# EAGLE schematic regsimple2addfp (EAGLE 7.6.0)

## Sheet 1 of 2
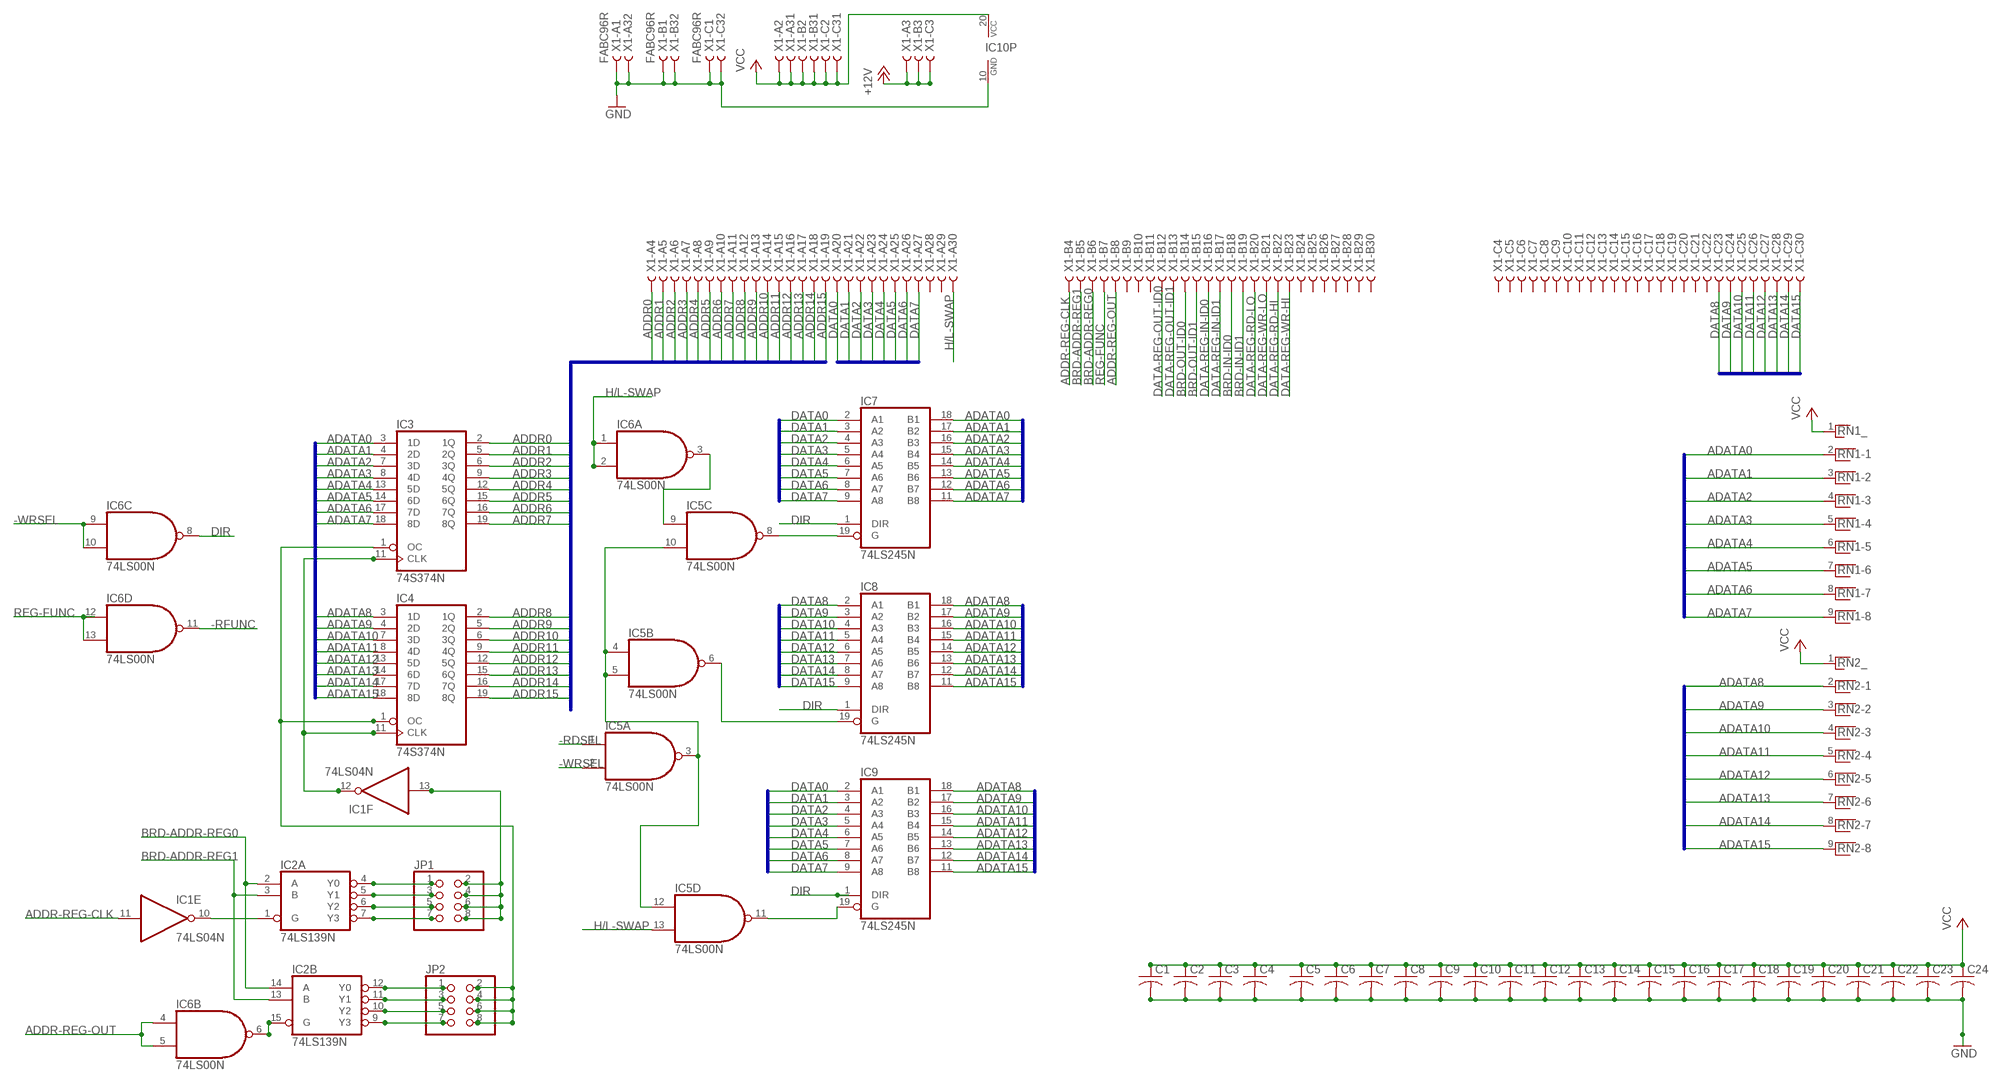
[diagram p0: schematic, sheet 1]

### Parts
C1  C-US025-040X050  [C025-040X050]
C2  C-US025-040X050  [C025-040X050]
C3  C-US025-040X050  [C025-040X050]
C4  C-US025-040X050  [C025-040X050]
C5  C-US025-040X050  [C025-040X050]
C6  C-US025-040X050  [C025-040X050]
C7  C-US025-040X050  [C025-040X050]
C8  C-US025-040X050  [C025-040X050]
C9  C-US025-040X050  [C025-040X050]
C10  C-US025-040X050  [C025-040X050]
C11  C-US025-040X050  [C025-040X050]
C12  C-US025-040X050  [C025-040X050]
C13  C-US025-040X050  [C025-040X050]
C14  C-US025-040X050  [C025-040X050]
C15  C-US025-040X050  [C025-040X050]
C16  C-US025-040X050  [C025-040X050]
C17  C-US025-040X050  [C025-040X050]
C18  C-US025-040X050  [C025-040X050]
C19  C-US025-040X050  [C025-040X050]
C20  C-US025-040X050  [C025-040X050]
C21  C-US025-040X050  [C025-040X050]
C22  C-US025-040X050  [C025-040X050]
C23  C-US025-040X050  [C025-040X050]
C24  C-US025-040X050  [C025-040X050]
IC1  74LS04N  [DIL14]
IC2  74LS139N  [DIL16]
IC3  74S374N  [DIL20]
IC4  74S374N  [DIL20]
IC5  74LS00N  [DIL14]
IC6  74LS00N  [DIL14]
IC7  74LS245N  [DIL20]
IC8  74LS245N  [DIL20]
IC9  74LS245N  [DIL20]
IC10  74S244N  [DIL20]
JP1  PINHD-2X4  [2X04]
JP2  PINHD-2X4  [2X04]
RN1  RNX8  [RN-9]
RN2  RNX8  [RN-9]
X1  FABC96R  [FABC96R]

### Nets
+12V: X1.A3 X1.B3 X1.C3
-RDSEL: IC5.1(A:I0) ; also sheet 2
-RFUNC: IC6.11(D:O) ; also sheet 2
-WRSEL: IC5.2(A:I1) IC6.9(C:I0) IC6.10(C:I1) ; also sheet 2
ADATA0: IC3.3(1D) IC7.18(B1) RN1.2 ; also sheet 2
ADATA1: IC3.4(2D) IC7.17(B2) RN1.3 ; also sheet 2
ADATA2: IC3.7(3D) IC7.16(B3) RN1.4 ; also sheet 2
ADATA3: IC3.8(4D) IC7.15(B4) RN1.5 ; also sheet 2
ADATA4: IC3.13(5D) IC7.14(B5) RN1.6 ; also sheet 2
ADATA5: IC3.14(6D) IC7.13(B6) RN1.7 ; also sheet 2
ADATA6: IC3.17(7D) IC7.12(B7) RN1.8 ; also sheet 2
ADATA7: IC3.18(8D) IC7.11(B8) RN1.9 ; also sheet 2
ADATA8: IC4.3(1D) IC8.18(B1) IC9.18(B1) RN2.2 ; also sheet 2
ADATA9: IC4.4(2D) IC8.17(B2) IC9.17(B2) RN2.3 ; also sheet 2
ADATA10: IC4.7(3D) IC8.16(B3) IC9.16(B3) RN2.4 ; also sheet 2
ADATA11: IC4.8(4D) IC8.15(B4) IC9.15(B4) RN2.5 ; also sheet 2
ADATA12: IC4.13(5D) IC8.14(B5) IC9.14(B5) RN2.6 ; also sheet 2
ADATA13: IC4.14(6D) IC8.13(B6) IC9.13(B6) RN2.7 ; also sheet 2
ADATA14: IC4.17(7D) IC8.12(B7) IC9.12(B7) RN2.8 ; also sheet 2
ADATA15: IC4.18(8D) IC8.11(B8) IC9.11(B8) RN2.9 ; also sheet 2
ADDR0: IC3.2(1Q) X1.A4
ADDR1: IC3.5(2Q) X1.A5
ADDR2: IC3.6(3Q) X1.A6
ADDR3: IC3.9(4Q) X1.A7
ADDR4: IC3.12(5Q) X1.A8
ADDR5: IC3.15(6Q) X1.A9
ADDR6: IC3.16(7Q) X1.A10
ADDR7: IC3.19(8Q) X1.A11
ADDR8: IC4.2(1Q) X1.A12
ADDR9: IC4.5(2Q) X1.A13
ADDR10: IC4.6(3Q) X1.A14
ADDR11: IC4.9(4Q) X1.A15
ADDR12: IC4.12(5Q) X1.A16
ADDR13: IC4.15(6Q) X1.A17
ADDR14: IC4.16(7Q) X1.A18
ADDR15: IC4.19(8Q) X1.A19
ADDR-REG-CLK: IC1.11(E:I) X1.B4
ADDR-REG-OUT: IC6.4(B:I0) IC6.5(B:I1) X1.B8
BRD-ADDR-REG0: IC2.2(A:A) IC2.14(B:A) X1.B6
BRD-ADDR-REG1: IC2.3(A:B) IC2.13(B:B) X1.B5
BRD-IN-ID0: X1.B18 ; also sheet 2
BRD-IN-ID1: X1.B19 ; also sheet 2
BRD-OUT-ID0: X1.B14 ; also sheet 2
BRD-OUT-ID1: X1.B15 ; also sheet 2
DATA0: IC7.2(A1) IC9.2(A1) X1.A20
DATA1: IC7.3(A2) IC9.3(A2) X1.A21
DATA2: IC7.4(A3) IC9.4(A3) X1.A22
DATA3: IC7.5(A4) IC9.5(A4) X1.A23
DATA4: IC7.6(A5) IC9.6(A5) X1.A24
DATA5: IC7.7(A6) IC9.7(A6) X1.A25
DATA6: IC7.8(A7) IC9.8(A7) X1.A26
DATA7: IC7.9(A8) IC9.9(A8) X1.A27
DATA8: IC8.2(A1) X1.C23
DATA9: IC8.3(A2) X1.C24
DATA10: IC8.4(A3) X1.C25
DATA11: IC8.5(A4) X1.C26
DATA12: IC8.6(A5) X1.C27
DATA13: IC8.7(A6) X1.C28
DATA14: IC8.8(A7) X1.C29
DATA15: IC8.9(A8) X1.C30
DATA-REG-IN-ID0: X1.B16 ; also sheet 2
DATA-REG-IN-ID1: X1.B17 ; also sheet 2
DATA-REG-OUT-ID0: X1.B12 ; also sheet 2
DATA-REG-OUT-ID1: X1.B13 ; also sheet 2
DATA-REG-RD-HI: X1.B22 ; also sheet 2
DATA-REG-RD-LO: X1.B20 ; also sheet 2
DATA-REG-WR-HI: X1.B23 ; also sheet 2
DATA-REG-WR-LO: X1.B21 ; also sheet 2
DIR: IC6.8(C:O) IC7.1(DIR) IC8.1(DIR) IC9.1(DIR)
GND: C1.2 C2.2 C3.2 C4.2 C5.2 C6.2 C7.2 C8.2 C9.2 C10.2 C11.2 C12.2 C13.2 C14.2 C15.2 C16.2 C17.2 C18.2 C19.2 C20.2 C21.2 C22.2 C23.2 C24.2 IC10.10(P:GND) X1.A1 X1.A32 X1.B1 X1.B32 X1.C1 X1.C32 ; also sheet 2
H/L-SWAP: IC5.13(D:I1) IC6.1(A:I0) IC6.2(A:I1) X1.A30
N$11: IC2.12(B:Y0) JP2.1
N$14: IC1.13(F:I) JP1.2 JP1.4 JP1.6 JP1.8
N$27: IC2.4(A:Y0) JP1.1
N$28: IC2.5(A:Y1) JP1.3
N$29: IC2.6(A:Y2) JP1.5
N$30: IC2.7(A:Y3) JP1.7
N$31: IC3.1(OC) IC4.1(OC) JP2.2 JP2.4 JP2.6 JP2.8
N$32: IC1.10(E:O) IC2.1(A:G)
N$33: IC1.12(F:O) IC3.11(CLK) IC4.11(CLK)
N$34: IC2.11(B:Y1) JP2.3
N$35: IC2.10(B:Y2) JP2.5
N$36: IC2.9(B:Y3) JP2.7
N$37: IC5.11(D:O) IC9.19(G)
N$38: IC5.8(C:O) IC7.19(G)
N$39: IC5.6(B:O) IC8.19(G)
N$40: IC5.3(A:O) IC5.4(B:I0) IC5.5(B:I1) IC5.10(C:I1) IC5.12(D:I0)
N$41: IC5.9(C:I0) IC6.3(A:O)
N$42: IC2.15(B:G) IC6.6(B:O)
REG-FUNC: IC6.12(D:I0) IC6.13(D:I1) X1.B7
VCC: C1.1 C2.1 C3.1 C4.1 C5.1 C6.1 C7.1 C8.1 C9.1 C10.1 C11.1 C12.1 C13.1 C14.1 C15.1 C16.1 C17.1 C18.1 C19.1 C20.1 C21.1 C22.1 C23.1 C24.1 IC10.20(P:VCC) RN1.1 RN2.1 X1.A2 X1.A31 X1.B2 X1.B31 X1.C2 X1.C31
Unconnected: IC10.1(A:G) IC10.2(A:A1) IC10.3(B:Y4) IC10.4(A:A2) IC10.5(B:Y3) IC10.6(A:A3) IC10.7(B:Y2) IC10.8(A:A4) IC10.9(B:Y1) IC10.11(B:A1) IC10.12(A:Y4) IC10.13(B:A2) IC10.14(A:Y3) IC10.15(B:A3) IC10.16(A:Y2) IC10.17(B:A4) IC10.18(A:Y1) IC10.19(B:G) X1.A28 X1.A29 X1.B9 X1.B10 X1.B11 X1.B24 X1.B25 X1.B26 X1.B27 X1.B28 X1.B29 X1.B30 X1.C4 X1.C5 X1.C6 X1.C7 X1.C8 X1.C9 X1.C10 X1.C11 X1.C12 X1.C13 X1.C14 X1.C15 X1.C16 X1.C17 X1.C18 X1.C19 X1.C20 X1.C21 X1.C22

### Buses
ADDR[0..15]
CNTL[0..53],DATA[8..15]
DATA[8..15]
DATA[0..7]
ADATA[0..15]
ADATA[0..7]
ADATA[8..15]

## Sheet 2 of 2
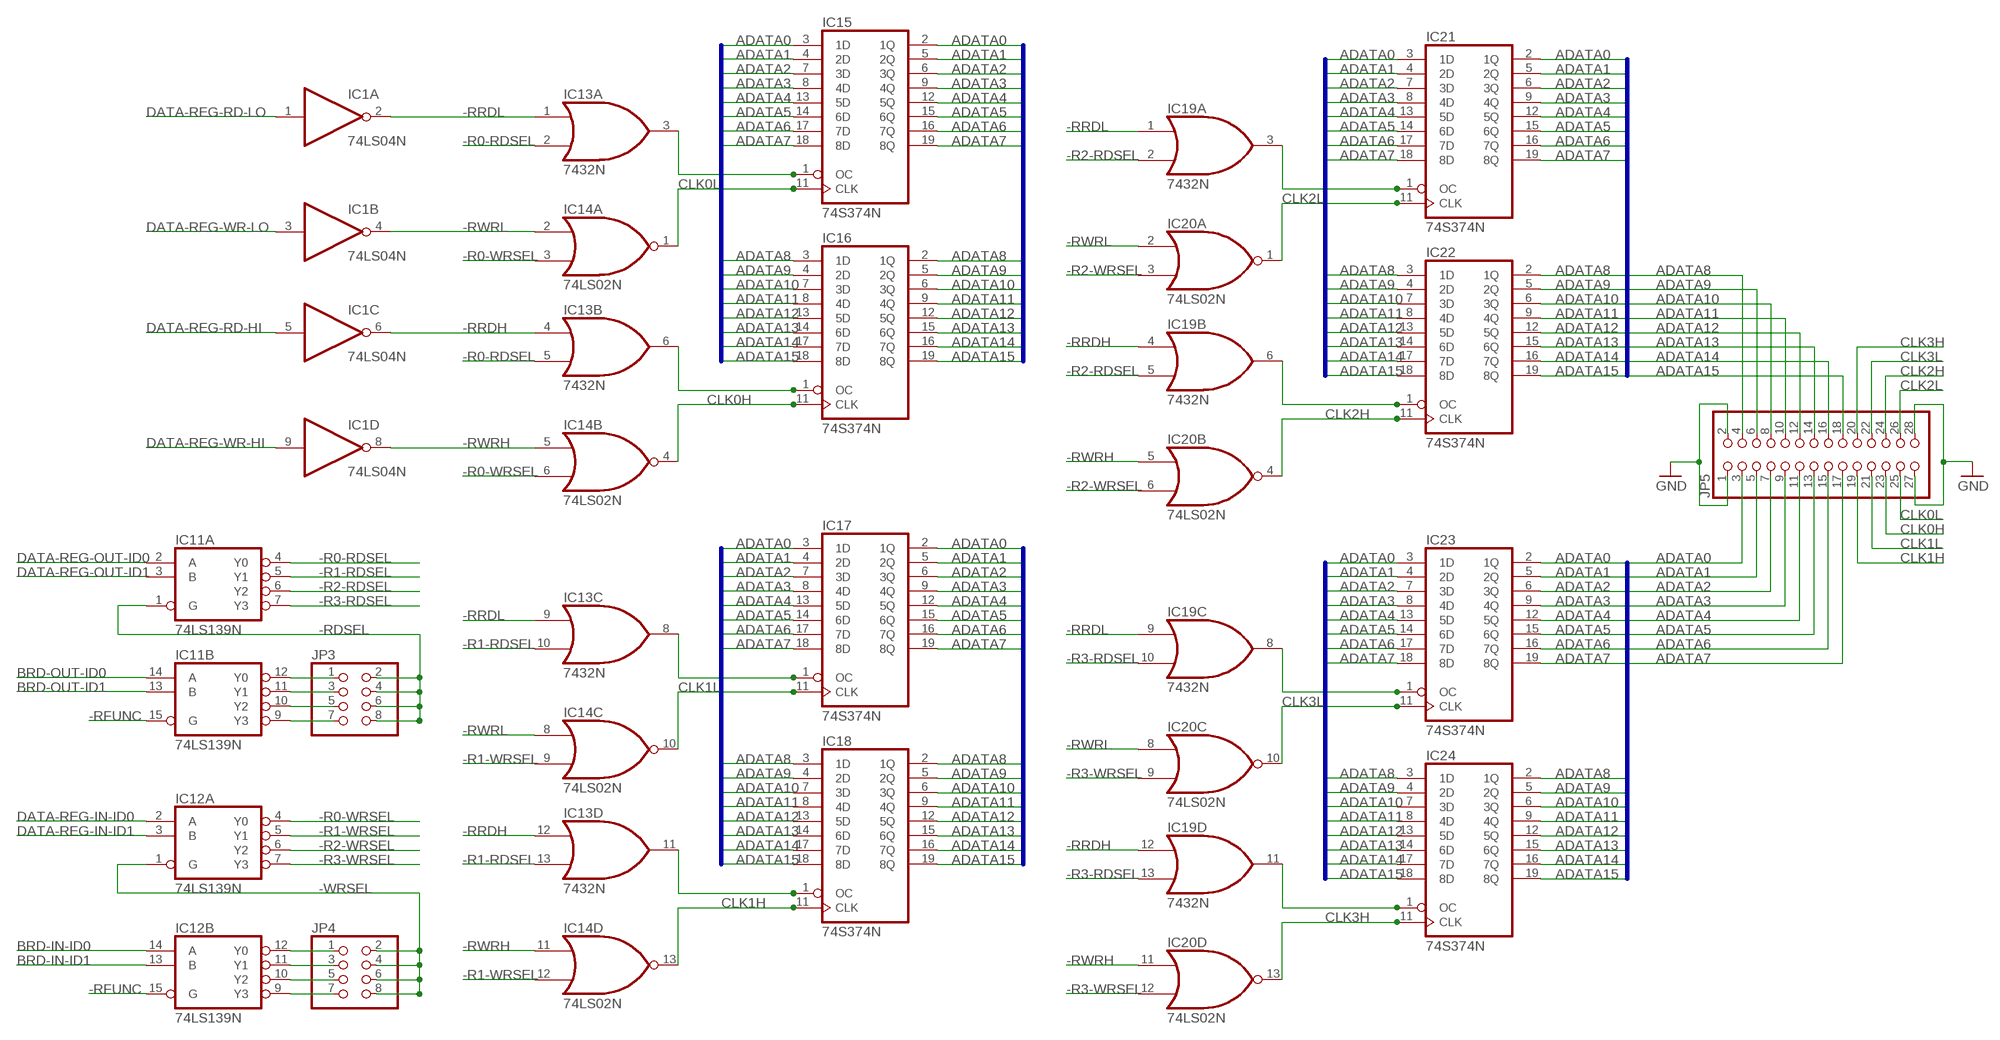
[diagram p1: schematic, sheet 2]

### Parts
IC11  74LS139N  [DIL16]
IC12  74LS139N  [DIL16]
IC13  7432N  [DIL14]
IC14  74LS02N  [DIL14]
IC15  74S374N  [DIL20]
IC16  74S374N  [DIL20]
IC17  74S374N  [DIL20]
IC18  74S374N  [DIL20]
IC19  7432N  [DIL14]
IC20  74LS02N  [DIL14]
IC21  74S374N  [DIL20]
IC22  74S374N  [DIL20]
IC23  74S374N  [DIL20]
IC24  74S374N  [DIL20]
JP3  PINHD-2X4  [2X04]
JP4  PINHD-2X4  [2X04]
JP5  PINHD-2X14  [2X14]

### Nets
-R0-RDSEL: IC11.4(A:Y0) IC13.2(A:I1) IC13.5(B:I1)
-R0-WRSEL: IC12.4(A:Y0) IC14.3(A:I1) IC14.6(B:I1)
-R1-RDSEL: IC11.5(A:Y1) IC13.10(C:I1) IC13.13(D:I1)
-R1-WRSEL: IC12.5(A:Y1) IC14.9(C:I1) IC14.12(D:I1)
-R2-RDSEL: IC11.6(A:Y2) IC19.2(A:I1) IC19.5(B:I1)
-R2-WRSEL: IC12.6(A:Y2) IC20.3(A:I1) IC20.6(B:I1)
-R3-RDSEL: IC11.7(A:Y3) IC19.10(C:I1) IC19.13(D:I1)
-R3-WRSEL: IC12.7(A:Y3) IC20.9(C:I1) IC20.12(D:I1)
-RDSEL: IC11.1(A:G) JP3.2 JP3.4 JP3.6 JP3.8 ; also sheet 1
-RFUNC: IC11.15(B:G) IC12.15(B:G) ; also sheet 1
-RRDH: IC1.6(C:O) IC13.4(B:I0) IC13.12(D:I0) IC19.4(B:I0) IC19.12(D:I0)
-RRDL: IC1.2(A:O) IC13.1(A:I0) IC13.9(C:I0) IC19.1(A:I0) IC19.9(C:I0)
-RWRH: IC1.8(D:O) IC14.5(B:I0) IC14.11(D:I0) IC20.5(B:I0) IC20.11(D:I0)
-RWRL: IC1.4(B:O) IC14.2(A:I0) IC14.8(C:I0) IC20.2(A:I0) IC20.8(C:I0)
-WRSEL: IC12.1(A:G) JP4.2 JP4.4 JP4.6 JP4.8 ; also sheet 1
ADATA0: IC15.2(1Q) IC15.3(1D) IC17.2(1Q) IC17.3(1D) IC21.2(1Q) IC21.3(1D) IC23.2(1Q) IC23.3(1D) JP5.3 ; also sheet 1
ADATA1: IC15.4(2D) IC15.5(2Q) IC17.4(2D) IC17.5(2Q) IC21.4(2D) IC21.5(2Q) IC23.4(2D) IC23.5(2Q) JP5.5 ; also sheet 1
ADATA2: IC15.6(3Q) IC15.7(3D) IC17.6(3Q) IC17.7(3D) IC21.6(3Q) IC21.7(3D) IC23.6(3Q) IC23.7(3D) JP5.7 ; also sheet 1
ADATA3: IC15.8(4D) IC15.9(4Q) IC17.8(4D) IC17.9(4Q) IC21.8(4D) IC21.9(4Q) IC23.8(4D) IC23.9(4Q) JP5.9 ; also sheet 1
ADATA4: IC15.12(5Q) IC15.13(5D) IC17.12(5Q) IC17.13(5D) IC21.12(5Q) IC21.13(5D) IC23.12(5Q) IC23.13(5D) JP5.11 ; also sheet 1
ADATA5: IC15.14(6D) IC15.15(6Q) IC17.14(6D) IC17.15(6Q) IC21.14(6D) IC21.15(6Q) IC23.14(6D) IC23.15(6Q) JP5.13 ; also sheet 1
ADATA6: IC15.16(7Q) IC15.17(7D) IC17.16(7Q) IC17.17(7D) IC21.16(7Q) IC21.17(7D) IC23.16(7Q) IC23.17(7D) JP5.15 ; also sheet 1
ADATA7: IC15.18(8D) IC15.19(8Q) IC17.18(8D) IC17.19(8Q) IC21.18(8D) IC21.19(8Q) IC23.18(8D) IC23.19(8Q) JP5.17 ; also sheet 1
ADATA8: IC16.2(1Q) IC16.3(1D) IC18.2(1Q) IC18.3(1D) IC22.2(1Q) IC22.3(1D) IC24.2(1Q) IC24.3(1D) JP5.4 ; also sheet 1
ADATA9: IC16.4(2D) IC16.5(2Q) IC18.4(2D) IC18.5(2Q) IC22.4(2D) IC22.5(2Q) IC24.4(2D) IC24.5(2Q) JP5.6 ; also sheet 1
ADATA10: IC16.6(3Q) IC16.7(3D) IC18.6(3Q) IC18.7(3D) IC22.6(3Q) IC22.7(3D) IC24.6(3Q) IC24.7(3D) JP5.8 ; also sheet 1
ADATA11: IC16.8(4D) IC16.9(4Q) IC18.8(4D) IC18.9(4Q) IC22.8(4D) IC22.9(4Q) IC24.8(4D) IC24.9(4Q) JP5.10 ; also sheet 1
ADATA12: IC16.12(5Q) IC16.13(5D) IC18.12(5Q) IC18.13(5D) IC22.12(5Q) IC22.13(5D) IC24.12(5Q) IC24.13(5D) JP5.12 ; also sheet 1
ADATA13: IC16.14(6D) IC16.15(6Q) IC18.14(6D) IC18.15(6Q) IC22.14(6D) IC22.15(6Q) IC24.14(6D) IC24.15(6Q) JP5.14 ; also sheet 1
ADATA14: IC16.16(7Q) IC16.17(7D) IC18.16(7Q) IC18.17(7D) IC22.16(7Q) IC22.17(7D) IC24.16(7Q) IC24.17(7D) JP5.16 ; also sheet 1
ADATA15: IC16.18(8D) IC16.19(8Q) IC18.18(8D) IC18.19(8Q) IC22.18(8D) IC22.19(8Q) IC24.18(8D) IC24.19(8Q) JP5.18 ; also sheet 1
BRD-IN-ID0: IC12.14(B:A) ; also sheet 1
BRD-IN-ID1: IC12.13(B:B) ; also sheet 1
BRD-OUT-ID0: IC11.14(B:A) ; also sheet 1
BRD-OUT-ID1: IC11.13(B:B) ; also sheet 1
CLK0H: IC14.4(B:O) IC16.11(CLK) JP5.23
CLK0L: IC14.1(A:O) IC15.11(CLK) JP5.25
CLK1H: IC14.13(D:O) IC18.11(CLK) JP5.19
CLK1L: IC14.10(C:O) IC17.11(CLK) JP5.21
CLK2H: IC20.4(B:O) IC22.11(CLK) JP5.24
CLK2L: IC20.1(A:O) IC21.11(CLK) JP5.26
CLK3H: IC20.13(D:O) IC24.11(CLK) JP5.20
CLK3L: IC20.10(C:O) IC23.11(CLK) JP5.22
DATA-REG-IN-ID0: IC12.2(A:A) ; also sheet 1
DATA-REG-IN-ID1: IC12.3(A:B) ; also sheet 1
DATA-REG-OUT-ID0: IC11.2(A:A) ; also sheet 1
DATA-REG-OUT-ID1: IC11.3(A:B) ; also sheet 1
DATA-REG-RD-HI: IC1.5(C:I) ; also sheet 1
DATA-REG-RD-LO: IC1.1(A:I) ; also sheet 1
DATA-REG-WR-HI: IC1.9(D:I) ; also sheet 1
DATA-REG-WR-LO: IC1.3(B:I) ; also sheet 1
GND: JP5.1 JP5.2 JP5.27 JP5.28 ; also sheet 1
N$1: IC13.3(A:O) IC15.1(OC)
N$2: IC11.12(B:Y0) JP3.1
N$3: IC11.11(B:Y1) JP3.3
N$4: IC11.10(B:Y2) JP3.5
N$5: IC11.9(B:Y3) JP3.7
N$6: IC12.12(B:Y0) JP4.1
N$7: IC12.11(B:Y1) JP4.3
N$8: IC12.10(B:Y2) JP4.5
N$9: IC12.9(B:Y3) JP4.7
N$12: IC13.8(C:O) IC17.1(OC)
N$15: IC19.3(A:O) IC21.1(OC)
N$17: IC19.8(C:O) IC23.1(OC)
N$19: IC13.11(D:O) IC18.1(OC)
N$21: IC19.11(D:O) IC24.1(OC)
N$23: IC19.6(B:O) IC22.1(OC)
N$25: IC13.6(B:O) IC16.1(OC)

### Buses
ADATA[0..15]

## Power pins joined to a net without a drawn wire
GND: IC1.7(P:GND) IC2.8(P:GND) IC3.10(GND) IC4.10(GND) IC5.7(P:GND) IC6.7(P:GND) IC7.10(GND) IC8.10(GND) IC9.10(GND) IC11.8(P:GND) IC12.8(P:GND) IC13.7(P:GND) IC14.7(P:GND) IC15.10(GND) IC16.10(GND) IC17.10(GND) IC18.10(GND) IC19.7(P:GND) IC20.7(P:GND) IC21.10(GND) IC22.10(GND) IC23.10(GND) IC24.10(GND)
VCC: IC1.14(P:VCC) IC2.16(P:VCC) IC3.20(VCC) IC4.20(VCC) IC5.14(P:VCC) IC6.14(P:VCC) IC7.20(VCC) IC8.20(VCC) IC9.20(VCC) IC11.16(P:VCC) IC12.16(P:VCC) IC13.14(P:VCC) IC14.14(P:VCC) IC15.20(VCC) IC16.20(VCC) IC17.20(VCC) IC18.20(VCC) IC19.14(P:VCC) IC20.14(P:VCC) IC21.20(VCC) IC22.20(VCC) IC23.20(VCC) IC24.20(VCC)

## Library data of the parts
C1-C24 = rcl:C-US: CAPACITOR, American symbol
IC1 = 74xx-us:74*04: Hex INVERTER
IC2 IC11 IC12 = 74xx-us:74*139: Dual 2-line to 4-line DECODER/DEMULTIPLEXER
IC3 IC4 IC15-IC18 IC21-IC24 = 74xx-us:74*374: Octal D type transparent LATCH, edge triggered
IC5 IC6 = 74xx-us:74*00: Quad 2-input NAND gate
IC7-IC9 = 74xx-us:74*245: Octal BUS TRANSCEIVER, 3-state
IC10 = 74xx-eu:74*244: Octal BUFFER and LINE DRIVER, 3-state
IC13 IC19 = 74xx-us:74*32: Quad 2-input OR gate
IC14 IC20 = 74xx-us:74*02: Quad 2-input NOR gate
JP1-JP4 = pinhead:PINHD-2X4: PIN HEADER
JP5 = pinhead:PINHD-2X14: PIN HEADER
RN1 RN2 = resistor-net:RNX8: RESISTOR NETWORK; OC_FARNELL: unknown; OC_NEWARK: unknown
X1 = con-vg:FABC96R: CONNECTOR female, 96 pins, type R, rows ABC, grid 2.54 mm